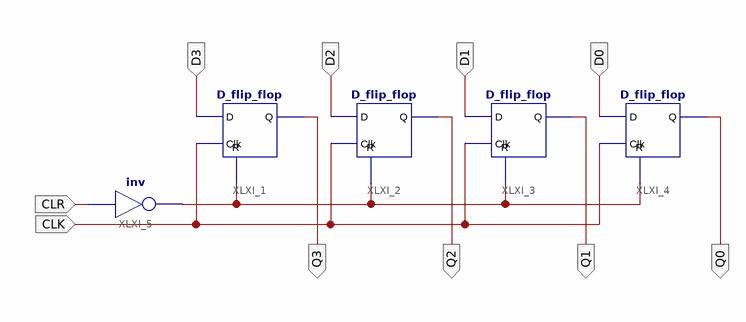
[diagram p0: schematic sheet 1]
// Xilinx ISE schematic Register_A.sch (virtex6) as structural Verilog: 5 symbols, 10 ports
module Register_A (
  input  CLK,
  input  CLR,
  input  D0,
  input  D2,
  input  D3,
  input  D1,
  output Q3,
  output Q2,
  output Q1,
  output Q0
);

  wire XLXN_4;

  D_flip_flop XLXI_1 (.Clk(CLK), .D(D3), .Q(Q3), .R(XLXN_4));
  D_flip_flop XLXI_2 (.Clk(CLK), .D(D2), .Q(Q2), .R(XLXN_4));
  D_flip_flop XLXI_3 (.Clk(CLK), .D(D1), .Q(Q1), .R(XLXN_4));
  D_flip_flop XLXI_4 (.Clk(CLK), .D(D0), .Q(Q0), .R(XLXN_4));
  not XLXI_5 (XLXN_4, CLR);
endmodule
